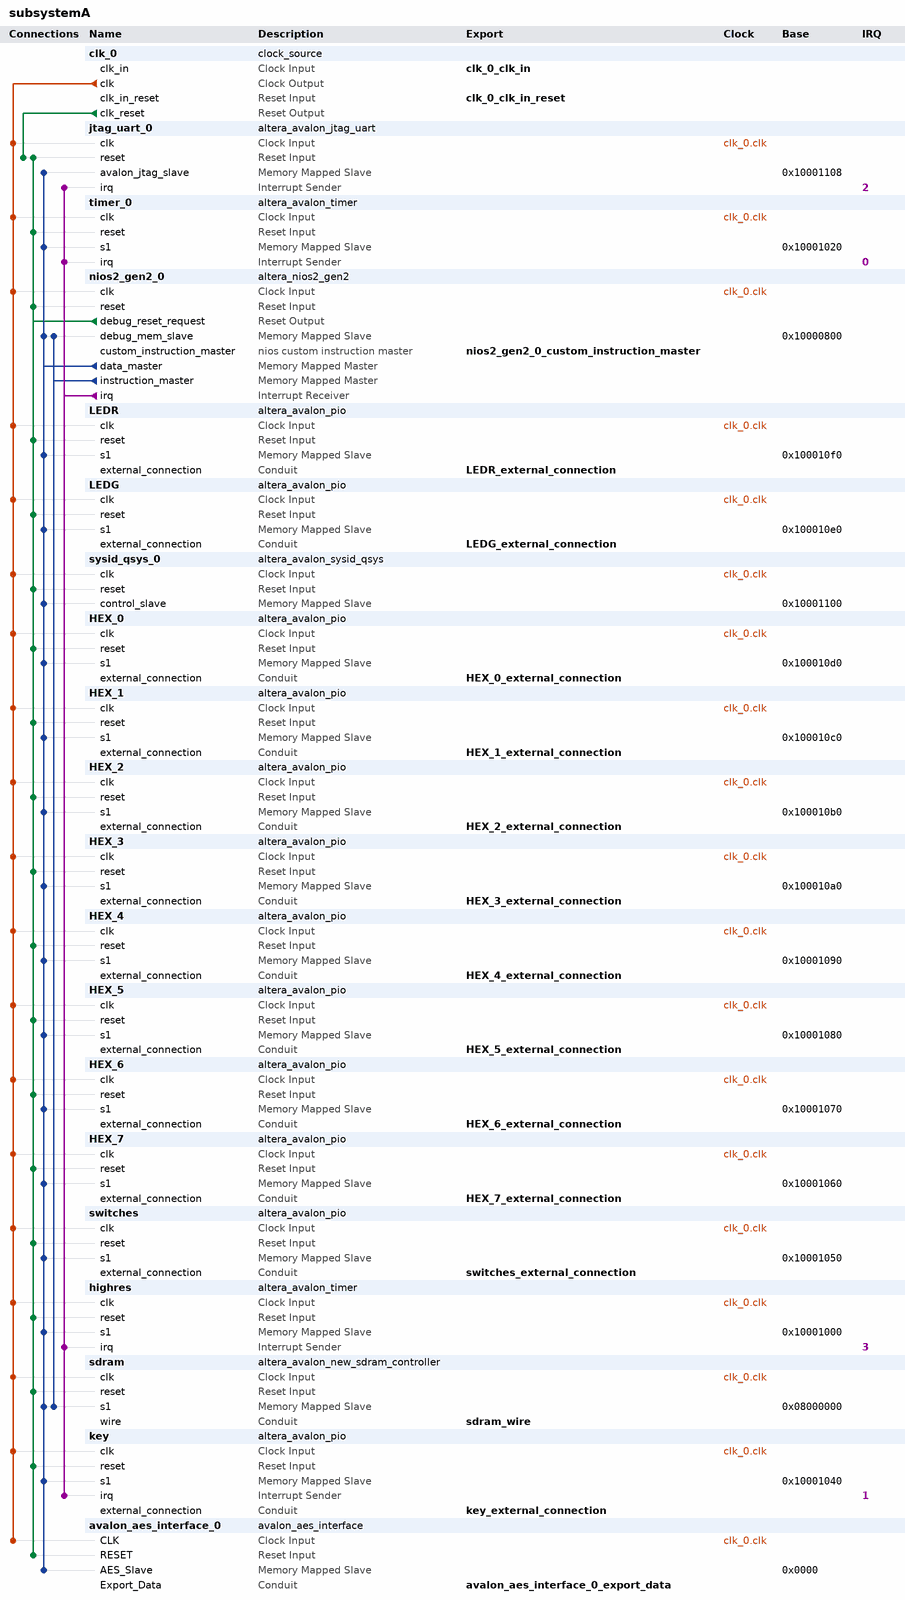
[diagram p0: system contents]
# Platform Designer (Qsys) system subsystemA, Cyclone IV E EP4CE115F29C7
# Parameters at their usual value, and those the tool derives, are not listed.
package require -exact qsys 16.1
create_system subsystemA
set_project_property DEVICE_FAMILY {Cyclone IV E}
set_project_property DEVICE EP4CE115F29C7

add_instance clk_0 clock_source 16.1
set_instance_parameter_value clk_0 clockFrequency 50000000

add_instance jtag_uart_0 altera_avalon_jtag_uart 16.1
set_instance_parameter_value jtag_uart_0 simInteractiveOptions NO_INTERACTIVE_WINDOWS

add_instance timer_0 altera_avalon_timer 16.1
set_instance_parameter_value timer_0 period 1
set_instance_parameter_value timer_0 periodUnits MSEC

add_instance nios2_gen2_0 altera_nios2_gen2 16.1
set_instance_parameter_value nios2_gen2_0 dcache_size 2048
set_instance_parameter_value nios2_gen2_0 exceptionSlave sdram.s1
set_instance_parameter_value nios2_gen2_0 icache_size 4096
set_instance_parameter_value nios2_gen2_0 impl Fast
set_instance_parameter_value nios2_gen2_0 resetSlave sdram.s1

add_instance LEDR altera_avalon_pio 16.1
set_instance_parameter_value LEDR direction Output
set_instance_parameter_value LEDR width 18

add_instance LEDG altera_avalon_pio 16.1
set_instance_parameter_value LEDG direction Output
set_instance_parameter_value LEDG width 8

add_instance sysid_qsys_0 altera_avalon_sysid_qsys 16.1
set_instance_parameter_value sysid_qsys_0 id 0

add_instance HEX_0 altera_avalon_pio 16.1
set_instance_parameter_value HEX_0 direction Output
set_instance_parameter_value HEX_0 width 7

add_instance HEX_1 altera_avalon_pio 16.1
set_instance_parameter_value HEX_1 direction Output
set_instance_parameter_value HEX_1 width 7

add_instance HEX_2 altera_avalon_pio 16.1
set_instance_parameter_value HEX_2 direction Output
set_instance_parameter_value HEX_2 width 7

add_instance HEX_3 altera_avalon_pio 16.1
set_instance_parameter_value HEX_3 direction Output
set_instance_parameter_value HEX_3 width 7

add_instance HEX_4 altera_avalon_pio 16.1
set_instance_parameter_value HEX_4 direction Output
set_instance_parameter_value HEX_4 width 7

add_instance HEX_5 altera_avalon_pio 16.1
set_instance_parameter_value HEX_5 direction Output
set_instance_parameter_value HEX_5 width 7

add_instance HEX_6 altera_avalon_pio 16.1
set_instance_parameter_value HEX_6 direction Output
set_instance_parameter_value HEX_6 width 7

add_instance HEX_7 altera_avalon_pio 16.1
set_instance_parameter_value HEX_7 direction Output
set_instance_parameter_value HEX_7 width 7

add_instance switches altera_avalon_pio 16.1
set_instance_parameter_value switches direction Input
set_instance_parameter_value switches width 18

add_instance highres altera_avalon_timer 16.1
set_instance_parameter_value highres period 1
set_instance_parameter_value highres periodUnits USEC

add_instance sdram altera_avalon_new_sdram_controller 16.1
set_instance_parameter_value sdram TAC 5.5
set_instance_parameter_value sdram TRCD 20.0
set_instance_parameter_value sdram TRP 20.0
set_instance_parameter_value sdram casLatency 3
set_instance_parameter_value sdram columnWidth 10
set_instance_parameter_value sdram dataWidth 32
set_instance_parameter_value sdram generateSimulationModel false
set_instance_parameter_value sdram model single_Micron_MT48LC4M32B2_7_chip
set_instance_parameter_value sdram numberOfBanks 4
set_instance_parameter_value sdram numberOfChipSelects 1
set_instance_parameter_value sdram powerUpDelay 100.0
set_instance_parameter_value sdram refreshPeriod 15.625
set_instance_parameter_value sdram rowWidth 13

add_instance key altera_avalon_pio 16.1
set_instance_parameter_value key captureEdge true
set_instance_parameter_value key direction Input
set_instance_parameter_value key edgeType FALLING
set_instance_parameter_value key generateIRQ true
set_instance_parameter_value key irqType EDGE
set_instance_parameter_value key width 4

add_instance avalon_aes_interface_0 avalon_aes_interface 1.0

# connections
add_connection clk_0.clk avalon_aes_interface_0.CLK clock
add_connection clk_0.clk HEX_0.clk clock
add_connection clk_0.clk HEX_1.clk clock
add_connection clk_0.clk HEX_2.clk clock
add_connection clk_0.clk HEX_3.clk clock
add_connection clk_0.clk HEX_4.clk clock
add_connection clk_0.clk HEX_5.clk clock
add_connection clk_0.clk HEX_6.clk clock
add_connection clk_0.clk HEX_7.clk clock
add_connection clk_0.clk highres.clk clock
add_connection clk_0.clk jtag_uart_0.clk clock
add_connection clk_0.clk key.clk clock
add_connection clk_0.clk LEDG.clk clock
add_connection clk_0.clk LEDR.clk clock
add_connection clk_0.clk nios2_gen2_0.clk clock
add_connection clk_0.clk sdram.clk clock
add_connection clk_0.clk switches.clk clock
add_connection clk_0.clk sysid_qsys_0.clk clock
add_connection clk_0.clk timer_0.clk clock
add_connection clk_0.clk_reset jtag_uart_0.reset reset
add_connection nios2_gen2_0.debug_reset_request avalon_aes_interface_0.RESET reset
add_connection nios2_gen2_0.debug_reset_request HEX_0.reset reset
add_connection nios2_gen2_0.debug_reset_request HEX_1.reset reset
add_connection nios2_gen2_0.debug_reset_request HEX_2.reset reset
add_connection nios2_gen2_0.debug_reset_request HEX_3.reset reset
add_connection nios2_gen2_0.debug_reset_request HEX_4.reset reset
add_connection nios2_gen2_0.debug_reset_request HEX_5.reset reset
add_connection nios2_gen2_0.debug_reset_request HEX_6.reset reset
add_connection nios2_gen2_0.debug_reset_request HEX_7.reset reset
add_connection nios2_gen2_0.debug_reset_request highres.reset reset
add_connection nios2_gen2_0.debug_reset_request jtag_uart_0.reset reset
add_connection nios2_gen2_0.debug_reset_request key.reset reset
add_connection nios2_gen2_0.debug_reset_request LEDG.reset reset
add_connection nios2_gen2_0.debug_reset_request LEDR.reset reset
add_connection nios2_gen2_0.debug_reset_request nios2_gen2_0.reset reset
add_connection nios2_gen2_0.debug_reset_request sdram.reset reset
add_connection nios2_gen2_0.debug_reset_request switches.reset reset
add_connection nios2_gen2_0.debug_reset_request sysid_qsys_0.reset reset
add_connection nios2_gen2_0.debug_reset_request timer_0.reset reset
add_connection nios2_gen2_0.data_master avalon_aes_interface_0.AES_Slave avalon
set_connection_parameter_value nios2_gen2_0.data_master/avalon_aes_interface_0.AES_Slave baseAddress 0x0000
add_connection nios2_gen2_0.data_master HEX_0.s1 avalon
set_connection_parameter_value nios2_gen2_0.data_master/HEX_0.s1 baseAddress 0x100010d0
add_connection nios2_gen2_0.data_master HEX_1.s1 avalon
set_connection_parameter_value nios2_gen2_0.data_master/HEX_1.s1 baseAddress 0x100010c0
add_connection nios2_gen2_0.data_master HEX_2.s1 avalon
set_connection_parameter_value nios2_gen2_0.data_master/HEX_2.s1 baseAddress 0x100010b0
add_connection nios2_gen2_0.data_master HEX_3.s1 avalon
set_connection_parameter_value nios2_gen2_0.data_master/HEX_3.s1 baseAddress 0x100010a0
add_connection nios2_gen2_0.data_master HEX_4.s1 avalon
set_connection_parameter_value nios2_gen2_0.data_master/HEX_4.s1 baseAddress 0x10001090
add_connection nios2_gen2_0.data_master HEX_5.s1 avalon
set_connection_parameter_value nios2_gen2_0.data_master/HEX_5.s1 baseAddress 0x10001080
add_connection nios2_gen2_0.data_master HEX_6.s1 avalon
set_connection_parameter_value nios2_gen2_0.data_master/HEX_6.s1 baseAddress 0x10001070
add_connection nios2_gen2_0.data_master HEX_7.s1 avalon
set_connection_parameter_value nios2_gen2_0.data_master/HEX_7.s1 baseAddress 0x10001060
add_connection nios2_gen2_0.data_master highres.s1 avalon
set_connection_parameter_value nios2_gen2_0.data_master/highres.s1 baseAddress 0x10001000
add_connection nios2_gen2_0.data_master jtag_uart_0.avalon_jtag_slave avalon
set_connection_parameter_value nios2_gen2_0.data_master/jtag_uart_0.avalon_jtag_slave baseAddress 0x10001108
add_connection nios2_gen2_0.data_master key.s1 avalon
set_connection_parameter_value nios2_gen2_0.data_master/key.s1 baseAddress 0x10001040
add_connection nios2_gen2_0.data_master LEDG.s1 avalon
set_connection_parameter_value nios2_gen2_0.data_master/LEDG.s1 baseAddress 0x100010e0
add_connection nios2_gen2_0.data_master LEDR.s1 avalon
set_connection_parameter_value nios2_gen2_0.data_master/LEDR.s1 baseAddress 0x100010f0
add_connection nios2_gen2_0.data_master nios2_gen2_0.debug_mem_slave avalon
set_connection_parameter_value nios2_gen2_0.data_master/nios2_gen2_0.debug_mem_slave baseAddress 0x10000800
add_connection nios2_gen2_0.data_master sdram.s1 avalon
set_connection_parameter_value nios2_gen2_0.data_master/sdram.s1 baseAddress 0x08000000
add_connection nios2_gen2_0.data_master switches.s1 avalon
set_connection_parameter_value nios2_gen2_0.data_master/switches.s1 baseAddress 0x10001050
add_connection nios2_gen2_0.data_master sysid_qsys_0.control_slave avalon
set_connection_parameter_value nios2_gen2_0.data_master/sysid_qsys_0.control_slave baseAddress 0x10001100
add_connection nios2_gen2_0.data_master timer_0.s1 avalon
set_connection_parameter_value nios2_gen2_0.data_master/timer_0.s1 baseAddress 0x10001020
add_connection nios2_gen2_0.instruction_master nios2_gen2_0.debug_mem_slave avalon
set_connection_parameter_value nios2_gen2_0.instruction_master/nios2_gen2_0.debug_mem_slave baseAddress 0x10000800
add_connection nios2_gen2_0.instruction_master sdram.s1 avalon
set_connection_parameter_value nios2_gen2_0.instruction_master/sdram.s1 baseAddress 0x08000000
add_connection nios2_gen2_0.irq highres.irq interrupt
set_connection_parameter_value nios2_gen2_0.irq/highres.irq irqNumber 3
add_connection nios2_gen2_0.irq jtag_uart_0.irq interrupt
set_connection_parameter_value nios2_gen2_0.irq/jtag_uart_0.irq irqNumber 2
add_connection nios2_gen2_0.irq key.irq interrupt
set_connection_parameter_value nios2_gen2_0.irq/key.irq irqNumber 1
add_connection nios2_gen2_0.irq timer_0.irq interrupt
set_connection_parameter_value nios2_gen2_0.irq/timer_0.irq irqNumber 0

# exported interfaces
add_interface HEX_0_external_connection conduit end
set_interface_property HEX_0_external_connection EXPORT_OF HEX_0.external_connection
add_interface HEX_1_external_connection conduit end
set_interface_property HEX_1_external_connection EXPORT_OF HEX_1.external_connection
add_interface HEX_2_external_connection conduit end
set_interface_property HEX_2_external_connection EXPORT_OF HEX_2.external_connection
add_interface HEX_3_external_connection conduit end
set_interface_property HEX_3_external_connection EXPORT_OF HEX_3.external_connection
add_interface HEX_4_external_connection conduit end
set_interface_property HEX_4_external_connection EXPORT_OF HEX_4.external_connection
add_interface HEX_5_external_connection conduit end
set_interface_property HEX_5_external_connection EXPORT_OF HEX_5.external_connection
add_interface HEX_6_external_connection conduit end
set_interface_property HEX_6_external_connection EXPORT_OF HEX_6.external_connection
add_interface HEX_7_external_connection conduit end
set_interface_property HEX_7_external_connection EXPORT_OF HEX_7.external_connection
add_interface LEDG_external_connection conduit end
set_interface_property LEDG_external_connection EXPORT_OF LEDG.external_connection
add_interface LEDR_external_connection conduit end
set_interface_property LEDR_external_connection EXPORT_OF LEDR.external_connection
add_interface avalon_aes_interface_0_export_data conduit end
set_interface_property avalon_aes_interface_0_export_data EXPORT_OF avalon_aes_interface_0.Export_Data
add_interface clk_0_clk_in clock sink
set_interface_property clk_0_clk_in EXPORT_OF clk_0.clk_in
add_interface clk_0_clk_in_reset reset sink
set_interface_property clk_0_clk_in_reset EXPORT_OF clk_0.clk_in_reset
add_interface key_external_connection conduit end
set_interface_property key_external_connection EXPORT_OF key.external_connection
add_interface nios2_gen2_0_custom_instruction_master nios_custom_instruction start
set_interface_property nios2_gen2_0_custom_instruction_master EXPORT_OF nios2_gen2_0.custom_instruction_master
add_interface sdram_wire conduit end
set_interface_property sdram_wire EXPORT_OF sdram.wire
add_interface switches_external_connection conduit end
set_interface_property switches_external_connection EXPORT_OF switches.external_connection

set_interconnect_requirement {$system} qsys_mm.clockCrossingAdapter HANDSHAKE
set_interconnect_requirement {$system} qsys_mm.enableEccProtection FALSE
set_interconnect_requirement {$system} qsys_mm.insertDefaultSlave FALSE
set_interconnect_requirement {$system} qsys_mm.maxAdditionalLatency 1

save_system subsystemA.qsys
